# Altium schematic sheet Main.SchDoc
size 449 x 299 mm; Author: İlker Keser; SheetNumber: 1; SheetTotal: 1
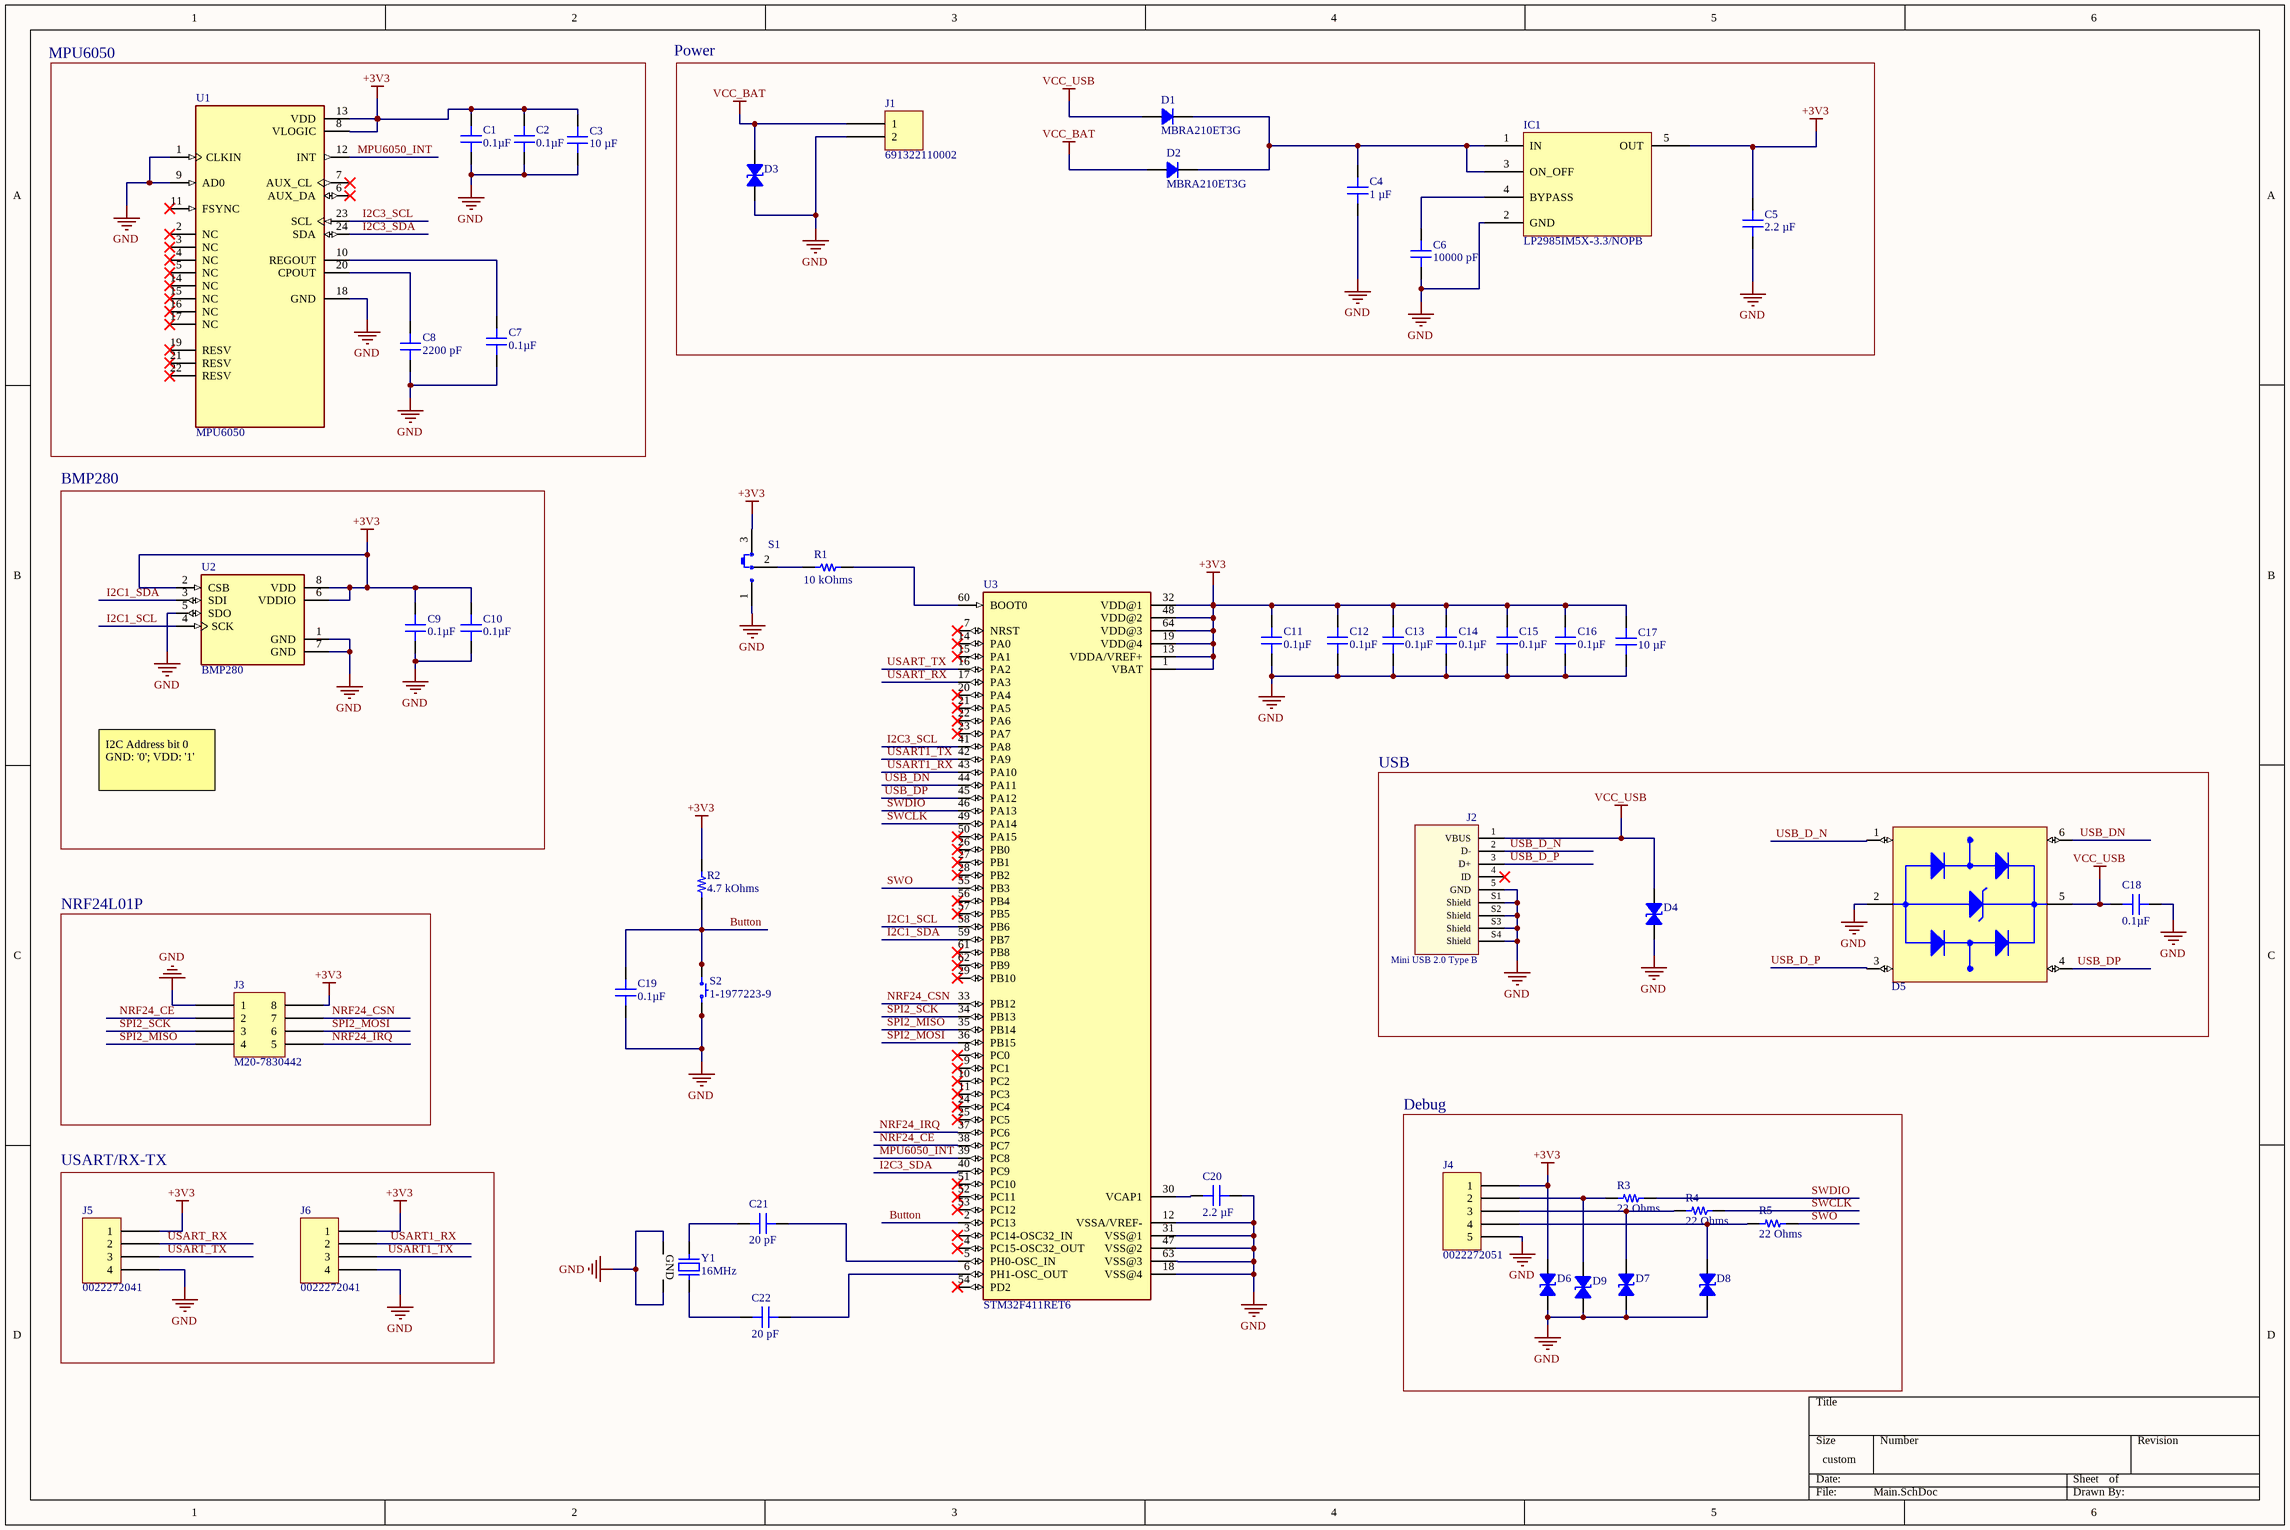
[diagram p0: Main.SchDoc]

## Parts
C1  0.1µF  [CAP 0603_1608]
C2  0.1µF  [CAP 0603_1608]
C3  10 µF  [MURATA GRM188 0603_1608]
C4  1 µF  [CAP 0603_1608]
C5  2.2 µF  [CAP 0603_1608]
C6  10000 pF  [CAP 0603_1608]
C7  0.1µF  [CAP 0603_1608]
C8  2200 pF  [CAP 0603_1608]
C9  0.1µF  [CAP 0603_1608]
C10  0.1µF  [CAP 0603_1608]
C11  0.1µF  [CAP 0603_1608]
C12  0.1µF  [CAP 0603_1608]
C13  0.1µF  [CAP 0603_1608]
C14  0.1µF  [CAP 0603_1608]
C15  0.1µF  [CAP 0603_1608]
C16  0.1µF  [CAP 0603_1608]
C17  10 µF  [MURATA GRM188 0603_1608]
C18  0.1µF  [CAP 0603_1608]
C19  0.1µF  [CAP 0603_1608]
C20  2.2 µF  [CAP 0603_1608]
C21  20 pF  [CAP 0603_1608]
C22  20 pF  [CAP 0603_1608]
D1  MBRA210ET3G  [DO214AC SMA]
D2  MBRA210ET3G  [DO214AC SMA]
D3  ESD5V0D5B-TP  [SOD523F]  (value not drawn)
D4  DESD5V0U1BA-7  [SOD323]  (value not drawn)
D5  USBLC6-2SC6  [SOT23-6L]  (value not drawn)
D6  DESD5V0U1BA-7  [SOD323]  (value not drawn)
D7  DESD5V0U1BA-7  [SOD323]  (value not drawn)
D8  DESD5V0U1BA-7  [SOD323]  (value not drawn)
D9  DESD5V0U1BA-7  [SOD323]  (value not drawn)
IC1  LP2985IM5X-3.3/NOPB  [TI SOT-23-5 DBV]
J1  691322110002  [WURTH 691322110002]
J2  Mini USB 2.0 Type B  [65100516121]
J3  M20-7830442  [HARWIN M20-7830445]
J4  0022272051  [MOLEX KK 0022272051]
J5  0022272041  [MOLEX KK 0022272041]
J6  0022272041  [MOLEX KK 0022272041]
R1  10 kOhms  [YAGEO RES 0603_1608]
R2  4.7 kOhms  [YAGEO RES 0603_1608]
R3  22 Ohms  [YAGEO RES 0603_1608]
R4  22 Ohms  [YAGEO RES 0603_1608]
R5  22 Ohms  [YAGEO RES 0603_1608]
S1  MS12ASG13  [NKK MS12ASG13]  (value not drawn)
S2  1-1977223-9  [TE FSM6JSMA]
U1  MPU6050  [MPU6050]
U2  BMP280  [BMP280]
U3  STM32F411RET6  [LQFP-64]
Y1  16MHz  [ABRACON ABM8G]

## Blocks framed on the sheet
MPU6050: C1-C3 C7 C8 U1
Power: C4-C6 D1-D3 IC1 J1
BMP280: C9 C10 U2
USB: C18 D4 D5 J2
NRF24L01P: J3
Debug: D6-D9 J4 R3-R5
USART/RX-TX: J5 J6

## Nets
+3V3: C1.2 C2.2 C3.2 C5.2 C9.2 C10.2 C11.2 C12.2 C13.2 C14.2 C15.2 C16.2 C17.2 D6.2 IC1.5(OUT) J3.8 J4.1 J5.1 J6.1 R2.2 S1.3 U1.8(VLOGIC) U1.13(VDD) U2.2(CSB) U2.6(VDDIO) U2.8(VDD) U3.1(VBAT) U3.13(VDDA/VREF+) U3.19(VDD@4) U3.32(VDD@1) U3.48(VDD@2) U3.64(VDD@3)
GND: C1.1 C2.1 C3.1 C4.1 C5.1 C6.1 C7.1 C8.1 C9.1 C10.1 C11.1 C12.1 C13.1 C14.1 C15.1 C16.1 C17.1 C18.2 C19.1 C20.2 D3.1 D4.1 D5.2(GND) D6.1 D7.1 D8.1 D9.1 IC1.2(GND) J1.2 J2.5(GND) J2.S1(Shield) J2.S2(Shield) J2.S3(Shield) J2.S4(Shield) J3.1 J4.5 J5.4 J6.4 S1.1 S2.3 S2.4 U1.1(CLKIN) U1.9(AD0) U1.18(GND) U2.1(GND) U2.5(SDO) U2.7(GND) U3.12(VSSA/VREF-) U3.18(VSS@4) U3.31(VSS@1) U3.47(VSS@2) U3.63(VSS@3) Y1.2(GND) Y1.4(GND)
VCC_BAT: D2.1 D3.2 J1.1
VCC_USB: C18.1 D1.1 D4.2 D5.5(VBUS) J2.1(VBUS)
Button: C19.2 R2.1 S2.1 S2.2 U3.2(PC13)
I2C1_SCL: U2.4(SCK) U3.58(PB6)
I2C1_SDA: U2.3(SDI) U3.59(PB7)
I2C3_SCL: U1.23(SCL) U3.41(PA8)
I2C3_SDA: U1.24(SDA) U3.40(PC9)
MPU6050_INT: U1.12(INT) U3.39(PC8)
NRF24_CE: J3.2 U3.38(PC7)
NRF24_CSN: J3.7 U3.33(PB12)
NRF24_IRQ: J3.5 U3.37(PC6)
SPI2_MISO: J3.4 U3.35(PB14)
SPI2_MOSI: J3.6 U3.36(PB15)
SPI2_SCK: J3.3 U3.34(PB13)
SWCLK: R4.2 U3.49(PA14)
SWDIO: R3.2 U3.46(PA13)
SWO: R5.2 U3.55(PB3)
USART1_RX: J6.2 U3.43(PA10)
USART1_TX: J6.3 U3.42(PA9)
USART_RX: J5.2 U3.17(PA3)
USART_TX: J5.3 U3.16(PA2)
USB_D_N: D5.1(I/O1_IN) J2.2(D-)
USB_D_P: D5.3(I/O2_IN) J2.3(D+)
USB_DN: D5.6(I/O1_OUT) U3.44(PA11)
USB_DP: D5.4(I/O2_OUT) U3.45(PA12)
NetC4_2: C4.2 D1.2 D2.2 IC1.1(IN) IC1.3(ON_OFF)
NetC6_2: C6.2 IC1.4(BYPASS)
NetC7_2: C7.2 U1.10(REGOUT)
NetC8_2: C8.2 U1.20(CPOUT)
NetC20_1: C20.1 U3.30(VCAP1)
NetC21_1: C21.1 Y1.1
NetC21_2: C21.2 U3.5(PH0-OSC_IN)
NetC22_1: C22.1 Y1.3
NetC22_2: C22.2 U3.6(PH1-OSC_OUT)
NetD7_2: D7.2 J4.3 R4.1
NetD8_2: D8.2 J4.4 R5.1
NetD9_2: D9.2 J4.2 R3.1
NetR1_1: R1.1 S1.2(COM)
NetR1_2: R1.2 U3.60(BOOT0)

Not connected (* = marked no-connect by the designer): J2 4(ID)*; U1 2(NC)* 3(NC)* 4(NC)* 5(NC)* 6(AUX_DA)* 7(AUX_CL)* 11(FSYNC)* 14(NC)* 15(NC)* 16(NC)* 17(NC)* 19(RESV)* 21(RESV)* 22(RESV)*; U3 3(PC14-OSC32_IN)* 4(PC15-OSC32_OUT)* 7(NRST)* 8(PC0)* 9(PC1)* 10(PC2)* 11(PC3)* 14(PA0)* 15(PA1)* 20(PA4)* 21(PA5)* 22(PA6)* 23(PA7)* 24(PC4)* 25(PC5)* 26(PB0)* 27(PB1)* 28(PB2)* 29(PB10)* 50(PA15)* 51(PC10)* 52(PC11)* 53(PC12)* 54(PD2)* 56(PB4)* 57(PB5)* 61(PB8)* 62(PB9)*

## Notes on the sheet
- I2C Address bit 0
  GND: '0'; VDD: '1'

## Library data of the parts
C1 C2 C7 C9-C16 C18 C19 = LD03ZC104KAB2A: CAP CER 0.1UF 10V X7R 0603; manufacturer: AVX Corporation; Tolerance: ±10%; Part Number: LD03ZC104KAB2A; Capacitance: 0.1µF; Applications: General Purpose; componentlink1description: Datasheet; componentlink1url: http://datasheets.avx.com/LD-Series.pdf; componentlink2description: DigiKey Link; componentlink2url: http://digikey.com/product-detail/en/avx-corporation/LD03ZC104KAB2A/478-12926-1-ND/9949296; Device Package: 0603 (1608 Metric); lastupdated: 2.09.2020 01:03:06; Lifecycle Status: Active; Minimum Order: 1; Mounting Type: Surface Mount, MLCC; Operating Temperature: -55°C ~ 125°C; Package / Case: 0603 (1608 Metric); packaging: TapeAndReel; partid: 16481; Part Status: Active; price: 0.17; series: LD; Size / Dimension: 0.063" L x 0.032" W (1.60mm x 0.81mm); Supplier 1: DigiKey; Supplier Part Number 1: 478-12926-1-ND; Temperature Coefficient: X7R; Thickness (Max): 0.035" (0.90mm); value: 0.1µF; Voltage - Rated: 10V
C3 C17 = GRM188C81A106MA73D: CAP CER 10UF 10V X6S 0603; manufacturer: Murata Electronics; Tolerance: ±20%; Part Number: GRM188C81A106MA73D; Capacitance: 10 µF; Applications: General Purpose; componentlink1description: Datasheet; componentlink1url: https://www.murata.com/~/media/webrenewal/support/library/catalog/products/capacitor/mlcc/c02e.ashx?la=en-us; componentlink2description: DigiKey Link; componentlink2url: https://www.digikey.com/en/products/detail/murata-electronics/GRM188C81A106MA73D/3900461; Device Package: 0603 (1608 Metric); lastupdated: 20.07.2024 00:23:22; Lifecycle Status: Active; Minimum Order: 1; Mounting Type: Surface Mount, MLCC; Operating Temperature: -55°C ~ 105°C; Package / Case: 0603 (1608 Metric); packaging: TapeAndReel; partid: 2456; Part Status: Active; price: 0.04; series: GRM; Size / Dimension: 0.063" L x 0.031" W (1.60mm x 0.80mm); Supplier 1: DigiKey; Supplier Part Number 1: 490-7197-1-ND; Temperature Coefficient: X6S; Thickness (Max): 0.039" (1.00mm); value: 10 µF; Voltage - Rated: 10V
C4 = CL10B105KA8NNNC: CAP CER 1UF 25V X7R 0603; manufacturer: Samsung Electro-Mechanics; Tolerance: ±10%; Part Number: CL10B105KA8NNNC; Capacitance: 1 µF; Applications: General Purpose; componentlink1description: Datasheet; componentlink1url: http://www.samsungsem.com/kr/support/product-search/mlcc/CL10B105KA8NNNC.jsp; componentlink2description: DigiKey Link; componentlink2url: https://www.digikey.com/en/products/detail/samsung-electro-mechanics/CL10B105KA8NNNC/3886842; Device Package: 0603 (1608 Metric); lastupdated: 9.02.2024 20:10:26; Lifecycle Status: Active; Minimum Order: 1; Mounting Type: Surface Mount, MLCC; Operating Temperature: -55°C ~ 125°C; Package / Case: 0603 (1608 Metric); packaging: TapeAndReel; partid: 5552; Part Status: Active; price: 0.01; series: CL; Size / Dimension: 0.063" L x 0.031" W (1.60mm x 0.80mm); Supplier 1: DigiKey; Supplier Part Number 1: 1276-1184-1-ND; Temperature Coefficient: X7R; Thickness (Max): 0.035" (0.90mm); value: 1 µF; Voltage - Rated: 25V
C5 = CL10A225KO8NNNC: CAP CER 2.2UF 16V X5R 0603; manufacturer: Samsung Electro-Mechanics; Tolerance: ±10%; Part Number: CL10A225KO8NNNC; Capacitance: 2.2 µF; Applications: General Purpose; componentlink1description: Datasheet; componentlink1url: http://www.samsungsem.com/kr/support/product-search/mlcc/CL10A225KO8NNNC.jsp; componentlink2description: DigiKey Link; componentlink2url: https://www.digikey.com/en/products/detail/samsung-electro-mechanics/CL10A225KO8NNNC/3886698; Device Package: 0603 (1608 Metric); lastupdated: 9.02.2024 20:10:26; Lifecycle Status: Active; Minimum Order: 1; Mounting Type: Surface Mount, MLCC; Operating Temperature: -55°C ~ 85°C; Package / Case: 0603 (1608 Metric); packaging: TapeAndReel; partid: 5651; Part Status: Active; price: 0.01; series: CL; Size / Dimension: 0.063" L x 0.031" W (1.60mm x 0.80mm); Supplier 1: DigiKey; Supplier Part Number 1: 1276-1040-1-ND; Temperature Coefficient: X5R; Thickness (Max): 0.035" (0.90mm); value: 2.2 µF; Voltage - Rated: 16V
C6 = CC0603MRX7R8BB103: CAP CER 10000PF 25V X7R 0603; manufacturer: Yageo; Tolerance: ±20%; Part Number: CC0603MRX7R8BB103; Capacitance: 10000 pF; Applications: General Purpose; componentlink1description: Datasheet; componentlink1url: https://www.yageo.com/upload/media/product/productsearch/datasheet/mlcc/UPY-GPHC_X7R_6.3V-to-50V_18.pdf; componentlink2description: DigiKey Link; componentlink2url: https://www.digikey.com/en/products/detail/yageo/CC0603MRX7R8BB103/5883820; Device Package: 0603 (1608 Metric); lastupdated: 9.02.2024 20:10:23; Lifecycle Status: Active; Minimum Order: 1; Mounting Type: Surface Mount, MLCC; Operating Temperature: -55°C ~ 125°C; Package / Case: 0603 (1608 Metric); packaging: TapeAndReel; partid: 7806; Part Status: Active; price: 0.01; series: CC; Size / Dimension: 0.063" L x 0.031" W (1.60mm x 0.80mm); Supplier 1: DigiKey; Supplier Part Number 1: 311-4108-1-ND; Temperature Coefficient: X7R; Thickness (Max): 0.035" (0.90mm); value: 10000 pF; Voltage - Rated: 25V
C8 = 885012006015: CAP CER 2200PF 10V C0G/NP0 0603; manufacturer: Würth Elektronik; Temperature Coefficient: C0G, NP0; Tolerance: ±5%; Part Number: 885012006015; Capacitance: 2200 pF; Applications: General Purpose; componentlink1description: Datasheet; componentlink1url: https://katalog.we-online.de/pbs/datasheet/885012006015.pdf; componentlink2description: DigiKey Link; componentlink2url: https://www.digikey.com/en/products/detail/würth-elektronik/885012006015/5455584; Device Package: 0603 (1608 Metric); lastupdated: 9.02.2024 20:10:22; Lifecycle Status: Active; Minimum Order: 1; Mounting Type: Surface Mount, MLCC; Operating Temperature: -55°C ~ 125°C; Package / Case: 0603 (1608 Metric); packaging: TapeAndReel; partid: 8918; Part Status: Active; price: 0.06; series: WCAP-CSGP; Size / Dimension: 0.063" L x 0.031" W (1.60mm x 0.80mm); Supplier 1: DigiKey; Supplier Part Number 1: 732-12250-1-ND; Thickness (Max): 0.034" (0.87mm); value: 2200 pF; Voltage - Rated: 10V
C20 = LMK107BJ225KAHT: CAP CER 2.2UF 10V X5R 0603; manufacturer: Taiyo Yuden; Tolerance: ±10%; Part Number: LMK107BJ225KAHT; Capacitance: 2.2 µF; Applications: Automotive; componentlink1description: Datasheet; componentlink1url: https://ds.yuden.co.jp/TYCOMPAS/ut/detail?pn=LMK107BJ225KAHT  &u=M; componentlink2description: DigiKey Link; componentlink2url: https://www.digikey.com/en/products/detail/taiyo-yuden/LMK107BJ225KAHT/4157763; Device Package: 0603 (1608 Metric); lastupdated: 9.02.2024 20:10:23; Lifecycle Status: Active; Minimum Order: 1; Mounting Type: Surface Mount, MLCC; Operating Temperature: -55°C ~ 85°C; Package / Case: 0603 (1608 Metric); packaging: TapeAndReel; partid: 39173; Part Status: Active; price: 0.01; Ratings: AEC-Q200; series: M; Size / Dimension: 0.063" L x 0.031" W (1.60mm x 0.80mm); Supplier 1: DigiKey; Supplier Part Number 1: 587-3414-1-ND; Temperature Coefficient: X5R; Thickness (Max): 0.035" (0.90mm); value: 2.2 µF; Voltage - Rated: 10V
C21 C22 = C0603C200G8HAC7867: CAP CER 20PF 10V X8R 0603; manufacturer: KEMET; Tolerance: ±2%; Part Number: C0603C200G8HAC7867; Capacitance: 20 pF; Applications: General Purpose; componentlink1description: Datasheet; componentlink1url: https://api.kemet.com/component-edge/download/datasheet/C0603C200G8HAC7867.pdf; componentlink2description: DigiKey Link; componentlink2url: https://www.digikey.com/en/products/detail/kemet/C0603C200G8HAC7867/7946222; Device Package: 0603 (1608 Metric); Features: Low ESL, High Temperature; lastupdated: 9.02.2024 20:09:59; Lifecycle Status: Active; Minimum Order: 1; Mounting Type: Surface Mount, MLCC; Operating Temperature: -55°C ~ 150°C; Package / Case: 0603 (1608 Metric); packaging: TapeAndReel; partid: 35714; Part Status: Active; price: 0.01; series: SMD Comm X8R HT150C; Size / Dimension: 0.063" L x 0.031" W (1.60mm x 0.80mm); Supplier 1: DigiKey; Supplier Part Number 1: 399-C0603C200G8HAC7867CT-ND; Temperature Coefficient: X8R; Thickness (Max): 0.034" (0.87mm); value: 20 pF; Voltage - Rated: 10V
D1 D2 = MBRA210ET3G: DIODE SCHOTTKY 10V 2A SMA; Manufacturer: ON Semiconductor; Current - Reverse Leakage @ Vr: 50µA @ 10V; Speed: Fast Recovery =< 500ns, > 200mA (Io); Voltage - Forward (Vf) (Max) @ If: 500mV @ 2A; Part Number: MBRA210ET3G; ComponentLink1Description: Datasheet; ComponentLink1URL: http://www.onsemi.com/pub/Collateral/MBRA210ET3-D.PDF; ComponentLink2Description: DigiKey Link; ComponentLink2URL: http://digikey.com/product-detail/en/on-semiconductor/MBRA210ET3G/MBRA210ET3GOSCT-ND/2705027; Current - Average Rectified (Io): 2A; Diode Type: Schottky; LastUpdated: 3.06.2024 19:54:30; Lifecycle Status: Active; Minimum Order: 1; Mounting Type: Surface Mount; Operating Temperature - Junction: -65°C ~ 150°C; Package / Case: DO-214AC, SMA; Packaging: TapeAndReel; PartId: 2119; Part Status: Active; Price: 0.19; Series: -; Supplier 1: DigiKey; Supplier Part Number 1: MBRA210ET3GOSCT-ND; Supplier Device Package: SMA; Voltage - DC Reverse (Vr) (Max): 10V
D3 = ESD5V0D5B-TP: TVS DIODE 5VWM 13VC SOD523; Manufacturer: Micro Commercial Co; Bidirectional Channels: 1; Capacitance @ Frequency: 27pF @ 1MHz; Current - Peak Pulse (10/1000µs): 12A; Power Line Protection: No; Power - Peak Pulse: 150W; Type: Zener; Voltage - Breakdown (Min): 5.8V; Voltage - Clamping (Max) @ Ipp: 13V; Voltage - Reverse Standoff (Typ): 5V (Max); Part Number: ESD5V0D5B-TP; Applications: General Purpose; ComponentLink1Description: Datasheet; ComponentLink1URL: https://www.mccsemi.com/pdf/Products/ESD5V0D5B(SOD-523).pdf; ComponentLink2Description: DigiKey Link; ComponentLink2URL: https://www.digikey.com/en/products/detail/micro-commercial-co/ESD5V0D5B-TP/2213550; LastUpdated: 3.06.2024 20:22:21; Lifecycle Status: Active; Minimum Order: 1; Mounting Type: Surface Mount; Operating Temperature: -55°C ~ 150°C (TJ); Package / Case: SC-79, SOD-523; Packaging: TapeAndReel; PartId: 9819; Part Status: Active; Price: 0.07; Series: -; Supplier 1: DigiKey; Supplier Part Number 1: ESD5V0D5B-TPMSCT-ND; Supplier Device Package: SOD-523
D4 D6-D9 = DESD5V0U1BA-7: TVS DIODE 5VWM 7.2VC SOD323; Manufacturer: Diodes Incorporated; Bidirectional Channels: 1; Capacitance @ Frequency: 2.9pF @ 1MHz; Current - Peak Pulse (10/1000µs): 3A (8/20µs); Power Line Protection: No; Type: Zener; Voltage - Breakdown (Min): 5.5V; Voltage - Clamping (Max) @ Ipp: 7.2V (Typ); Voltage - Reverse Standoff (Typ): 5V (Max); Part Number: DESD5V0U1BA-7; Applications: General Purpose; ComponentLink1Description: Datasheet; ComponentLink1URL: https://www.diodes.com/assets/Datasheets/DESD5V0U1BA.pdf; ComponentLink2Description: DigiKey Link; ComponentLink2URL: https://www.digikey.com/en/products/detail/diodes-incorporated/DESD5V0U1BA-7/5371876; LastUpdated: 3.06.2024 20:22:28; Lifecycle Status: Active; Minimum Order: 1; Mounting Type: Surface Mount; Operating Temperature: -65°C ~ 150°C (TJ); Package / Case: SC-76, SOD-323; Packaging: TapeAndReel; PartId: 9987; Part Status: Active; Price: 0.02; Series: -; Supplier 1: DigiKey; Supplier Part Number 1: DESD5V0U1BA-7DICT-ND; Supplier Device Package: SOD-323
D5 = USBLC6-2SC6: 15V Clamp 6A (8/20µs) Ipp Tvs Diode Surface Mount SOT-23-6; Designed by: İK; Voltage - Reverse Standoff (Typ): 5.25V; Voltage - Breakdown (Min): 6V; Voltage - Clamping (Max) @ Ipp: 17V; Current - Peak Pulse (10/1000µs): 5A (8/20µs); Operating Temperature: -40°C ~ 150°C (TJ); Package / Case: SOT23-6; ComponentLink1Description: Datasheet; ComponentLink1URL: https://mm.digikey.com/Volume0/opasdata/d220001/medias/docus/5338/USBLC6-2SC6.pdf; ComponentLink2Description: Digikey Link; ComponentLink2URL: https://www.digikey.com/en/products/detail/umw/usblc6-2sc6/16705896
IC1 = LP2985IM5X-3.3/NOPB: IC REG LINEAR 3.3V 150MA SOT23-5; Manufacturer: Texas Instruments; Control Features: Enable; Current - Quiescent (Iq): 95 µA; Current - Supply (Max): 2.5 mA; Number of Regulators: 1; Output Configuration: Positive; Output Type: Fixed; Protection Features: Over Current, Over Temperature, Short Circuit; PSRR: 45dB (1kHz); Voltage Dropout (Max): 0.58V @ 150mA; Voltage - Input (Max): 16V; Part Number: LP2985IM5X-3.3/NOPB; ComponentLink1Description: Datasheet; ComponentLink1URL: http://www.ti.com/general/docs/suppproductinfo.tsp?distId=10&gotoUrl=http%3A%2F%2Fwww.ti.com%2Flit%2Fgpn%2Flp2985-n; ComponentLink2Description: DigiKey Link; ComponentLink2URL: https://www.digikey.com/en/products/detail/texas-instruments/LP2985IM5X-3-3-NOPB/367679; Current - Output: 150mA; LastUpdated: 21.06.2022 13:01:53; Lifecycle Status: Active; Minimum Order: 1; Mounting Type: Surface Mount; Operating Temperature: -40°C ~ 125°C; Package / Case: SC-74A, SOT-753; Packaging: TapeAndReel; Part Status: Active; Price: 0.45; Series: -; Supplier 1: DigiKey; Supplier Part Number 1: LP2985IM5X-3.3/NOPBCT-ND; Supplier Device Package: SOT-23-5; Voltage - Output (Min/Fixed): 3.3V
J1 = 691322110002: TERM BLOCK HDR 2POS 90DEG 3.5MM; Manufacturer: Würth Elektronik; Current - UL: 10 A; Header Orientation: 90°, Right Angle; Number of Levels: 1; Number of Positions: 2; Pitch: 0.138" (3.50mm); Voltage - UL: 300 V; Part Number: 691322110002; Color: Green; ComponentLink1Description: Datasheet; ComponentLink1URL: https://katalog.we-online.de/em/datasheet/6913221100xx.pdf; ComponentLink2Description: DigiKey Link; ComponentLink2URL: https://www.digikey.com/en/products/detail/würth-elektronik/691322110002/2508538; Contact Mating Finish: Tin; LastUpdated: 21.06.2022 14:48:48; Lifecycle Status: Active; Minimum Order: 1; Mounting Type: Through Hole; Operating Temperature: -40°C ~ 105°C; Packaging: Bulk; Part Status: Active; Positions Per Level: 2; Price: 0.26; Series: WR-TBL Series 3221; Supplier 1: DigiKey; Supplier Part Number 1: 732-2769-ND; Termination Style: Solder; Type: Header, Male Pins, Shrouded (4 Side)
J2 = 65100516121: Mini USB 2.0 Type B Horizontal SMT 5 Contacts WR-COM; Rated Current: 1 A; Gender: Female; ComponentLink1Description: Manufacturer; ComponentLink1URL: http://www.we-online.de; ComponentLink2Description: Datasheet; ComponentLink2URL: http://katalog.we-online.de/em/datasheet/65100516121.pdf; Part Number: 65100516121; Published Date: May 2018; Publisher: Wurth Elektronik; Orientation: Horizontal; Interface Type: Mini USB 2.0 Type B; Operating Temperature: -40 to 105 degC; Mounting Technology: SMT; Packaging: Tray
J3 = M20-7830442: CONN RCPT 8POS 0.1 GOLD PCB; Manufacturer: Harwin Inc.; Connector Type: Receptacle; Contact Length - Post: 0.118" (3.00mm); Current Rating (Amps): 3A; Mated Stacking Heights: 11.04mm, 12.63mm; Material Flammability Rating: UL94 V-0; Number of Positions: 8; Number of Positions Loaded: All; Pitch - Mating: 0.100" (2.54mm); Style: Board to Board or Cable; Part Number: M20-7830442; ComponentLink1Description: Datasheet; ComponentLink1URL: https://cdn.harwin.com/pdfs/C001XX_M20_Series_Connectors.pdf; ComponentLink2Description: DigiKey Link; ComponentLink2URL: http://digikey.com/product-detail/en/harwin-inc/M20-7830442/952-1789-ND/3727758; Contact Finish - Mating: Gold; Contact Finish - Post: Tin; Contact Finish Thickness - Mating: Flash; Contact Type: Female Socket; Fastening Type: Push-Pull; Insulation Color: Black; Insulation Height: 0.335" (8.51mm); LastUpdated: 21.09.2022 19:04:26; Lifecycle Status: Active; Minimum Order: 1; Mounting Type: Through Hole; Number of Rows: 2; Operating Temperature: -40°C ~ 105°C; Packaging: Tube; Part Status: Active; Price: 1.36; Row Spacing - Mating: 0.100" (2.54mm); Series: M20; Supplier 1: DigiKey; Supplier Part Number 1: 952-1789-ND; Termination: Solder
J4 = 0022272051: CONN HEADER VERT 5POS 2.54MM; Manufacturer: Molex; Contact Length - Mating: 0.295" (7.49mm); Contact Length - Post: 0.140" (3.56mm); Material Flammability Rating: UL94 V-0; Number of Positions: 5; Number of Positions Loaded: All; Overall Contact Length: 0.560" (14.22mm); Pitch - Mating: 0.100" (2.54mm); Shrouding: Shrouded - 1 Wall; Style: Board to Cable/Wire; Part Number: 0022272051; ComponentLink1Description: Datasheet; ComponentLink1URL: https://www.molex.com/pdm_docs/sd/022272051_sd.pdf; ComponentLink2Description: DigiKey Link; ComponentLink2URL: http://digikey.com/product-detail/en/molex/0022272051/WM4114-ND/1130580; Connector Type: Header; Contact Finish - Mating: Tin; Contact Finish - Post: Tin; Contact Finish Thickness - Mating: 100.0µin (2.54µm); Contact Material: Brass; Contact Shape: Square; Contact Type: Male Pin; Fastening Type: Friction Lock; Insulation Color: Natural; Insulation Height: 0.461" (11.70mm); Insulation Material: Polyamide (PA), Nylon; LastUpdated: 12.01.2020 23:52:16; Lifecycle Status: Active; Minimum Order: 1; Mounting Type: Through Hole; Number of Rows: 1; Packaging: Bulk; PartId: 79; Part Status: Active; Price: 0.46; Series: KK 6410; Supplier 1: DigiKey; Supplier Part Number 1: WM4114-ND; Termination: Solder
J5 J6 = 0022272041: CONN HEADER VERT 4POS 2.54MM; Manufacturer: Molex; Contact Length - Mating: 0.295" (7.49mm); Contact Length - Post: 0.140" (3.56mm); Material Flammability Rating: UL94 V-0; Number of Positions: 4; Number of Positions Loaded: All; Overall Contact Length: 0.560" (14.22mm); Pitch - Mating: 0.100" (2.54mm); Shrouding: Shrouded - 1 Wall; Style: Board to Cable/Wire; Part Number: 0022272041; ComponentLink1Description: Datasheet; ComponentLink1URL: https://www.molex.com/pdm_docs/sd/022272041_sd.pdf; ComponentLink2Description: DigiKey Link; ComponentLink2URL: http://digikey.com/product-detail/en/molex/0022272041/WM4113-ND/1130579; Connector Type: Header; Contact Finish - Mating: Tin; Contact Finish - Post: Tin; Contact Finish Thickness - Mating: 100.0µin (2.54µm); Contact Material: Brass; Contact Shape: Square; Contact Type: Male Pin; Fastening Type: Friction Lock; Insulation Color: Natural; Insulation Height: 0.461" (11.70mm); Insulation Material: Polyamide (PA), Nylon; LastUpdated: 12.01.2020 23:52:05; Lifecycle Status: Active; Minimum Order: 1; Mounting Type: Through Hole; Number of Rows: 1; Packaging: Bulk; PartId: 78; Part Status: Active; Price: 0.40; Series: KK 6410; Supplier 1: DigiKey; Supplier Part Number 1: WM4113-ND; Termination: Solder
R1 = AC0603FR-1310KL: RES 10K OHM 1% 1/10W 0603; Manufacturer: Yageo; Power (Watts): 0.1W, 1/10W; Temperature Coefficient: ±100ppm/°C; Part Number: AC0603FR-1310KL; Value: 10 kOhms; ComponentLink1Description: Datasheet; ComponentLink1URL: https://www.yageo.com/upload/media/product/productsearch/datasheet/rchip/PYu-AC_51_RoHS_L_8.pdf; ComponentLink2Description: DigiKey Link; ComponentLink2URL: https://www.digikey.com/en/products/detail/yageo/AC0603FR-1310KL/13694194; Composition: Thick Film; Device Package: 0603 (1608 Metric); Features: Automotive AEC-Q200, Moisture Resistant; Height - Seated (Max): 0.022" (0.55mm); LastUpdated: 25.07.2024 09:19:08; Lifecycle Status: Active; Minimum Order: 1; Number of Terminations: 2; Operating Temperature: -55°C ~ 155°C; Package / Case: 0603 (1608 Metric); Packaging: CutTape; PartId: 67630; Part Status: Active; Price: 0.01; Ratings: AEC-Q200; Resistance: 10 kOhms; Series: AC; Size / Dimension: 0.063" L x 0.031" W (1.60mm x 0.80mm); Supplier 1: DigiKey; Supplier Part Number 1: 13-AC0603FR-1310KLCT-ND; Supplier Device Package: 0603; Tolerance: ±1%
R2 = AC0603FR-134K7L: RES 4.7K OHM 1% 1/10W 0603; Manufacturer: Yageo; Power (Watts): 0.1W, 1/10W; Temperature Coefficient: ±100ppm/°C; Part Number: AC0603FR-134K7L; Value: 4.7 kOhms; ComponentLink1Description: Datasheet; ComponentLink1URL: https://www.yageo.com/upload/media/product/productsearch/datasheet/rchip/PYu-AC_51_RoHS_L_8.pdf; ComponentLink2Description: DigiKey Link; ComponentLink2URL: https://www.digikey.com/en/products/detail/yageo/AC0603FR-134K7L/14008318; Composition: Thick Film; Device Package: 0603 (1608 Metric); Height - Seated (Max): 0.022" (0.55mm); LastUpdated: 25.07.2024 09:19:09; Lifecycle Status: Active; Minimum Order: 1; Number of Terminations: 2; Operating Temperature: -55°C ~ 155°C; Package / Case: 0603 (1608 Metric); Packaging: CutTape; PartId: 66748; Part Status: Active; Price: 0.01; Ratings: AEC-Q200; Resistance: 4.7 kOhms; Series: AC; Size / Dimension: 0.063" L x 0.031" W (1.60mm x 0.80mm); Supplier 1: DigiKey; Supplier Part Number 1: 13-AC0603FR-134K7LCT-ND; Supplier Device Package: 0603; Tolerance: ±1%
R3-R5 = AC0603FR-0722RL: RES SMD 22 OHM 1% 1/10W 0603; Manufacturer: Yageo; Power (Watts): 0.1W, 1/10W; Temperature Coefficient: ±100ppm/°C; Part Number: AC0603FR-0722RL; Value: 22 Ohms; ComponentLink1Description: Datasheet; ComponentLink1URL: https://www.yageo.com/upload/media/product/productsearch/datasheet/rchip/PYu-AC_51_RoHS_L_7.pdf; ComponentLink2Description: DigiKey Link; ComponentLink2URL: https://www.digikey.com/en/products/detail/yageo/AC0603FR-0722RL/5895927; Composition: Thick Film; Device Package: 0603 (1608 Metric); Features: Automotive AEC-Q200, Moisture Resistant; Height - Seated (Max): 0.022" (0.55mm); LastUpdated: 25.07.2024 09:19:25; Lifecycle Status: Active; Minimum Order: 1; Number of Terminations: 2; Operating Temperature: -55°C ~ 155°C; Package / Case: 0603 (1608 Metric); Packaging: CutTape; PartId: 16487; Part Status: Active; Price: 0.01; Ratings: AEC-Q200; Resistance: 22 Ohms; Series: AC; Size / Dimension: 0.063" L x 0.031" W (1.60mm x 0.80mm); Supplier 1: DigiKey; Supplier Part Number 1: YAG3581CT-ND; Supplier Device Package: 0603; Tolerance: ±1%
S1 = MS12ASG13: SWITCH SLIDE SPDT 0.4VA 28V; Manufacturer: NKK Switches; Actuator Length: 5.10mm; Actuator Type: Standard; Contact Timing: Non-Shorting (BBM); Current Rating (Amps): 0.4VA (AC/DC); Switch Function: On-On; Part Number: MS12ASG13; Circuit: SPDT; ComponentLink1Description: Datasheet; ComponentLink1URL: https://www.nkkswitches.com/pdf/MSnonilluminated.pdf; ComponentLink2Description: DigiKey Link; ComponentLink2URL: https://www.digikey.com/en/products/detail/nkk-switches/MS12ASG13/1052535; Contact Finish: Gold; Contact Material: Copper; Features: Epoxy Sealed Terminals; LastUpdated: 26.09.2022 03:18:31; Lifecycle Status: Active; Minimum Order: 1; Mounting Type: Through Hole; Operating Temperature: -30°C ~ 85°C; Packaging: Bulk; PartId: 6; Part Status: Active; Price: 2.95; Series: MS; Supplier 1: DigiKey; Supplier Part Number 1: 360-2388-ND; Termination Style: PC Pin; Voltage Rating - AC: 28 V; Voltage Rating - DC: 28 V
S2 = 1-1977223-9: SWITCH TACTILE SPST-NO 0.05A 24V; Manufacturer: TE Connectivity ALCOSWITCH Switches; Actuator Height off PCB, Vertical: 7.00mm; Actuator Orientation: Top Actuated; Actuator Type: Standard; Contact Rating @ Voltage: 0.05A @ 24VDC; Illumination: Non-Illuminated; Operating Force: 260gf; Outline: 6.00mm x 6.00mm; Switch Function: Off-Mom; Part Number: 1-1977223-9; Circuit: SPST-NO; ComponentLink1Description: Datasheet; ComponentLink1URL: https://www.te.com/commerce/DocumentDelivery/DDEController?Action=srchrtrv&DocNm=1308111-1_SWITCHES_CORE_PROGRAM_CATALOG&DocType=CS&DocLang=English; ComponentLink2Description: DigiKey Link; ComponentLink2URL: http://digikey.com/product-detail/en/te-connectivity-alcoswitch-switches/1-1977223-9/1-1977223-9-ND/5401299; LastUpdated: 3.06.2024 20:19:31; Lifecycle Status: Active; Minimum Order: 1500; Mounting Type: Surface Mount; Packaging: Bulk; Price: 0.36; Series: FSMJSMA; Supplier 1: DigiKey; Supplier Part Number 1: 1-1977223-9-ND; Termination Style: Gull Wing
U1 = MPU6050: Accelerometer, Gyroscope, 6 Axis Sensor I2C Output; Manufacturer: TDK InvenSense; Sensor Type: Accelerometer, Gyroscope, 6 Axis; Output Type: I2C; Operating Temperature: -40°C ~ 85°C; Package / Case: 24-VFQFN Module Exposed Pad; ComponentLink1Description: Datasheet; ComponentLink1URL: https://invensense.tdk.com/wp-content/uploads/2015/02/MPU-6000-Datasheet1.pdf
U2 = BMP280: Pressure Sensor 4.35PSI ~ 15.95PSI (30kPa ~ 110kPa) Absolute 16b 8-SMD; Manufacturer: Bosch Sensortec; Output Type: I2C, SPI; Accuracy: ±0.015PSI (±0.1kPa); Voltage - Supply: 1.71V ~ 3.6V; Port Style: No Port; Maximum Pressure: 290.08PSI (2000kPa); Pressure Type: Absolute; Operating Pressure: 4.35PSI ~ 15.95PSI (30kPa ~ 110kPa); Output: 16b; Features: Standby Mode; Termination Style: SMD (SMT) Tab; Operating Temperature: -40°C ~ 85°C; Mounting Type: Surface Mount; Package / Case: 8-SMD; ComponentLink1Description: Datasheet; ComponentLink1URL: https://www.bosch-sensortec.com/media/boschsensortec/downloads/datasheets/bst-bmp280-ds001.pdf
U3 = STM32F411RET6: ARM® Cortex®-M4 STM32F4 Microcontroller IC 32-Bit Single-Core 100MHz 512KB (512K x 8) FLASH 64-LQFP (10x10); Manufacturer: ST; Connectivity: I2C, IrDA, LINbus, MMC/SD/SDIO, SPI, UART/USART, USB OTG; Peripherals: Brown-out Detect/Reset, DMA, I2S, POR, PWM, WDT; Number of I/O: 50; RAM Size: 128K x 8; Voltage - Supply (Vcc/Vdd): 1.7V ~ 3.6V; Data Converters: A/D 16x12b; Oscillator Type: Internal; Series: STM32F4; Speed: 100MHz; Core Size: 32-Bit Single-Core; Core Processor: ARM® Cortex®-M4; Program Memory Size: 512KB (512K x 8); Program Memory Type: FLASH; Operating Temperature: -40°C ~ 85°C (TA); Mounting Type: Surface Mount; Supplier Device Package: 64-LQFP (10x10); Package / Case: 64-LQFP; ComponentLink1Description: Datasheet; ComponentLink1URL: https://www.st.com/content/ccc/resource/technical/document/datasheet/b3/a5/46/3b/b4/e5/4c/85/DM00115249.pdf/files/DM00115249.pdf/jcr:content/translations/en.DM00115249.pdf; ComponentLink2Description: Digikey Link; ComponentLink2URL: https://www.digikey.com/en/products/detail/stmicroelectronics/stm32f411ret6/4935722
Y1 = ABM8G-16.000MHZ-18-D2Y-T3: CRYSTAL 16.0000MHZ 18PF SMD; Manufacturer: Abracon LLC; ESR (Equivalent Series Resistance): 80 Ohms; Frequency Stability: ±30ppm; Frequency Tolerance: ±20ppm; Operating Mode: Fundamental; Part Number: ABM8G-16.000MHZ-18-D2Y-T3; ComponentLink1Description: Datasheet; ComponentLink1URL: https://abracon.com/Resonators/ABM8G.pdf; ComponentLink2Description: DigiKey Link; ComponentLink2URL: http://digikey.com/product-detail/en/abracon-llc/ABM8G-16.000MHZ-18-D2Y-T3/535-14314-1-ND/8538154; Device Package: 4-SMD, No Lead; Frequency: 16MHz; Height - Seated (Max): 0.039" (1.00mm); LastUpdated: 19.03.2020 22:36:25; Lifecycle Status: Active; Load Capacitance: 18pF; Minimum Order: 1; Mounting Type: Surface Mount; Operating Temperature: -40°C ~ 85°C; Package / Case: 4-SMD, No Lead; Packaging: TapeAndReel; PartId: 348; Part Status: Active; Price: 0.51; Series: ABM8G; Size / Dimension: 0.126" L x 0.098" W (3.20mm x 2.50mm); Supplier 1: DigiKey; Supplier Part Number 1: 535-14314-1-ND; Type: MHz Crystal; Value: 16MHz